# Altium schematic sheet [Acoustics] Power.SchDoc: Sample Sheet Title
size B; Date: MM/DD/YYYY; Author: Nathan A, Rebecca Y, Rebecca L; Organization: ORGANIZATION; Address1: ADDRESS 1; Address2: ADDRESS 2; Address3: ADDRESS 3; Address4: ADDRESS 4; Revision: -; SheetNumber: 3; SheetTotal: 6; ENG_APP_DATE: --/--/--; DSN_APP_DATE: --/--/--; CHK_APP_DATE: --/--/--
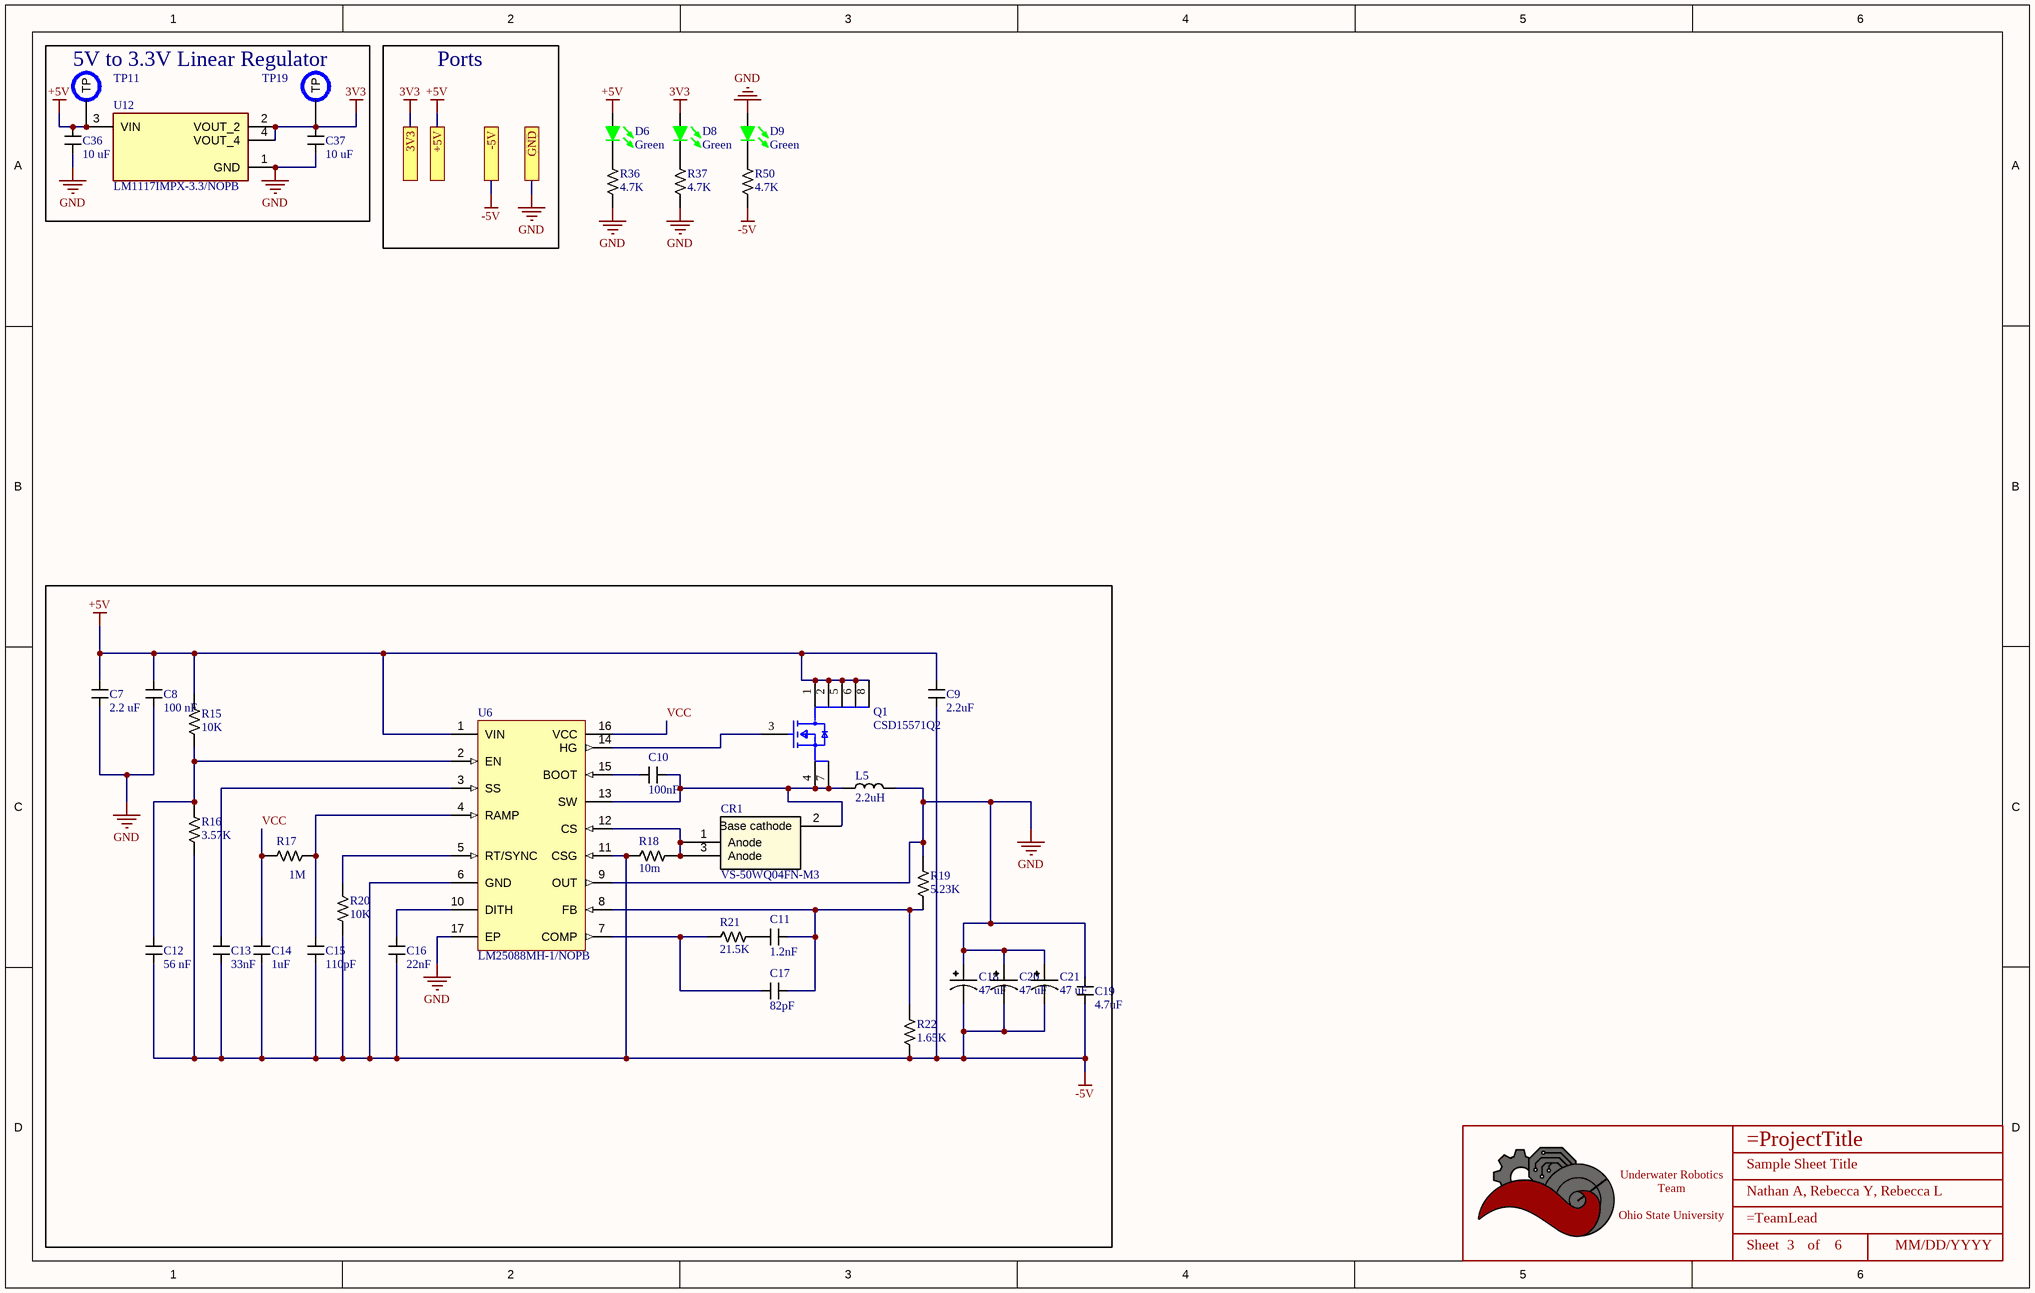
[diagram p0: [Acoustics] Power.SchDoc]

## Parts
*  Title_Block  [LOGO]  (value not drawn)  (graphical)
C7  value 2.2 uF  [CAPACITOR_0402]  (hidden comment: 1uF Ceramic 16V)
C8  value 100 nF  [CAPACITOR_0402]  (hidden comment: 1uF Ceramic 16V)
C9  value 2.2uF  [CAPACITOR_0402]  (hidden comment: 1uF Ceramic 16V)
C10  value 100nF  [CAPACITOR_0402]  (hidden comment: 1uF Ceramic 16V)
C11  value 1.2nF  [CAPACITOR_0402]  (hidden comment: 1uF Ceramic 16V)
C12  value 56 nF  [CAPACITOR_0402]  (hidden comment: 1uF Ceramic 16V)
C13  value 33nF  [CAPACITOR_0402]  (hidden comment: 1uF Ceramic 16V)
C14  value 1uF  [CAPACITOR_0402]  (hidden comment: 1uF Ceramic 16V)
C15  value 110pF  [CAPACITOR_0402]  (hidden comment: 1uF Ceramic 16V)
C16  value 22nF  [CAPACITOR_0402]  (hidden comment: 1uF Ceramic 16V)
C17  value 82pF  [CAPACITOR_0402]  (hidden comment: 1uF Ceramic 16V)
C18  Value (uF): 47 uF  [CAPACITOR_1206 - POLAR]  (hidden comment: 10uF Tantalum 16V)
C19  value 4.7uF  [CAPACITOR_0402]  (hidden comment: 1uF Ceramic 16V)
C20  Value (uF): 47 uF  [CAPACITOR_1206 - POLAR]  (hidden comment: 10uF Tantalum 16V)
C21  Value (uF): 47 uF  [CAPACITOR_1206 - POLAR]  (hidden comment: 10uF Tantalum 16V)
C36  Value (uF): 10 uF  [CAPACITOR_0603]  (hidden comment: 10uF Ceramic 6.3V)
C37  Value (uF): 10 uF  [CAPACITOR_0603]  (hidden comment: 10uF Ceramic 6.3V)
CR1  VS-50WQ04FN-M3  [D2PAK_VIS]
D6  Color: Green  [LED_0603]  (hidden comment: IN-S63AT5G)
D8  Color: Green  [LED_0603]  (hidden comment: IN-S63AT5G)
D9  Color: Green  [LED_0603]  (hidden comment: IN-S63AT5G)
L5  value 2.2uH  [INDUCTOR_0402]  (hidden comment: FIXED IND 15NH 250MA 600MOHM SMD)
Q1  CSD15571Q2  [FP-DQK0006C-MFG]
R15  Value  (Ohms): 10K  [RESISTOR_0402]  (hidden comment: 1k Ohm 1% 1/16W)
R16  Value  (Ohms): 3.57K  [RESISTOR_0402]  (hidden comment: 1k Ohm 1% 1/16W)
R17  Value  (Ohms): 1M  [RESISTOR_0402]  (hidden comment: 1k Ohm 1% 1/16W)
R18  Value  (Ohms): 10m  [RESISTOR_0402]  (hidden comment: 1k Ohm 1% 1/16W)
R19  Value  (Ohms): 5.23K  [RESISTOR_0402]  (hidden comment: 1k Ohm 1% 1/16W)
R20  Value  (Ohms): 10K  [RESISTOR_0402]  (hidden comment: 1k Ohm 1% 1/16W)
R21  Value  (Ohms): 21.5K  [RESISTOR_0402]  (hidden comment: 1k Ohm 1% 1/16W)
R22  Value  (Ohms): 1.65K  [RESISTOR_0402]  (hidden comment: 1k Ohm 1% 1/16W)
R36  Value  (Ohms): 4.7K  [RESISTOR_0603]  (hidden comment: 4.7k Ohm 5% 1/10W)
R37  Value  (Ohms): 4.7K  [RESISTOR_0603]  (hidden comment: 4.7k Ohm 5% 1/10W)
R50  Value  (Ohms): 4.7K  [RESISTOR_0603]  (hidden comment: 4.7k Ohm 5% 1/10W)
TP11  PCB Test Point  [TESTPOINT_1.2MM]  (value not drawn)  (no BOM)
TP19  PCB Test Point  [TESTPOINT_1.2MM]  (value not drawn)  (no BOM)
U6  LM25088MH-1/NOPB  [PWP0016A_N]
U12  LM1117IMPX-3.3/NOPB  [SOT-223-4]

## Blocks framed on the sheet
5V to 3.3V Linear Regulator: C36 C37 TP11 TP19 U12

## Ports
3V3, +5V, -5V, GND

## Nets
3V3: C37.1 D8.1 TP19.TP U12.2(VOUT_2) U12.4(VOUT_4) ; port 3V3
+5V: C7.1 C8.1 C9.1 C36.1 D6.1 Q1.1(D) Q1.2(D) Q1.5(D) Q1.6(D) Q1.8(D) R15.1 TP11.TP U6.1(VIN) U12.3(VIN) ; port +5V
-5V: C9.2 C12.2 C13.2 C14.2 C15.2 C16.2 C18.2 C19.2 C20.2 C21.2 R16.2 R18.2 R20.1 R22.2 R50.2 U6.6(GND) U6.11(CSG) ; port -5V
GND: C7.2 C8.2 C18.1 C19.1 C20.1 C21.1 C36.2 C37.2 D9.1 L5.1 R19.1 R36.2 R37.2 U6.9(OUT) U6.17(EP) U12.1(GND) ; port GND
VCC: C14.1 R17.1 U6.16(VCC)
NetC10_1: C10.1 CR1.2(Base_cathode) L5.2 Q1.4(S) Q1.7(S) U6.13(SW)
NetC10_2: C10.2 U6.15(BOOT)
NetC11_1: C11.1 C17.1 R19.2 R22.1 U6.8(FB)
NetC11_2: C11.2 R21.1
NetC12_1: C12.1 R15.2 R16.1 U6.2(EN)
NetC13_1: C13.1 U6.3(SS)
NetC15_1: C15.1 R17.2 U6.4(RAMP)
NetC16_1: C16.1 U6.10(DITH)
NetC17_2: C17.2 R21.2 U6.7(COMP)
NetCR1_1: CR1.1(Anode) CR1.3(Anode) R18.1 U6.12(CS)
NetD6_2: D6.2 R36.1
NetD8_2: D8.2 R37.1
NetD9_2: D9.2 R50.1
NetQ1_3: Q1.3(G) U6.14(HG)
NetR20_2: R20.2 U6.5(RT/SYNC)

## Notes on the sheet
- Ports
- DWG. NO.
- REV.
- SHT.
- THIS DOCUMENT AND THE DATA DISCLOSED HEREIN OR HEREWITH IS THE PROPERTY OF ALTIUM LIMITED AND MAY BE FREELY DISTRIBUTED IN WHOLE. NO RIGHTS ARE RESERVED OR EXPRESS OR IMPLIED WARANTEE GIVEN.
- REVISION
- DESCRIPTION
- DATE
- APPROVED
- ENG:
- APPROVALS
- PROJECT
- DSN:
- CHK:
- REFERENCE DOCUMENTS
- PROJECT REVISION:
- TITLE
- DOCUMENT REVISION:
- DESIGN ITEM:
- BOM:
- FAB DWG:
- PCB DWG:
- ASSY DWG:
- SCALE:
- SIZE
- B
- CAGE CODE
- FILE NAME
- DWG NO.
- SHEET
- OF
- REV
- (in symbol Title_Block) Underwater Robotics Team / Ohio State University; Sheet; of

## Library data of the parts
* = Title_Block: UWRT Schematic Title Block Template / Created June 2021, Dylan Trainor
C7-C17 C19 = CAPACITOR_1uF_0402: Cap 1uF 16V +/-10% / Ceramic 0402; Made By: Robert Pafford; Tolerance: +/- 10%; Voltage: 16V; Supplier 1: Digikey
  C7 C9: Supplier Part Number 1: 445-9097-1-ND
  C8 C10: Supplier Part Number 1: 399-C0402C104K8PACTUCT-ND
  C11: Supplier Part Number 1: 311-1031-1-ND
  C12: Supplier Part Number 1: 311-3805-1-ND
  C13: Supplier Part Number 1: 490-3253-1-ND
  C14: Supplier Part Number 1: 399-C0402C105K8PACTUCT-ND
  C15: Supplier Part Number 1: 399-C0402C110J5GACTUCT-ND
  C16: Supplier Part Number 1: 311-1722-1-ND
  C17: Supplier Part Number 1: 490-GCM1555C1H820JA16DCT-ND
  C19: Supplier Part Number 1: 445-13820-1-ND
C18 C20 C21 = CAPACITOR_10uF_1206_Tantalum_1: Cap 10uF 16V +/-20% / Tantalum 1206; Tolerance: +/- 10%; Made By: Dylan T; ComponentLink1Description: Digikey; ComponentLink1URL: https://www.digikey.com/en/products/detail/kyocera-avx/F981A106MMA/4004990; Voltage: 16V; Supplier 1: Digikey; Supplier Part Number 1: 478-5800-1-ND
C36 C37 = CAPACITOR_10uF_0603: Cap 10uF 6.3V +/-20% / Ceramic 0603; Made By: Flip B; ComponentLink1Description: Digikey; ComponentLink1URL: https://www.digikey.com/en/products/detail/samsung-electro-mechanics/CL10A106MQ8NNNC/3886777; Supplier 1: Digi-Key; Supplier Part Number 1: 1276-1119-1-ND; Tolerance: +/- 20%; Voltage: 6.3V
CR1 = VS-50WQ04FN-M3: No Description Available; Mfr_Name: Vishay; RefDes: RefDes; Type: Type; Supplier 1: Digikey; Supplier Part Number 1: VS-50WQ04FN-M3-ND
D6 D8 D9 = LED_Green_0603_3V: LED Green Vf= 3V If = 0.005A / IN-S63AT5G; Made By: Robert Pafford; Forward Current: 5mA; ComponentLink1Description: Datasheet; ComponentLink1URL: https://www.we-online.de/katalog/datasheet/150060GS75000.pdf; Forward Voltage: 3V; Package: 0603; Supplier 1: Digi-Key; Supplier Part Number 1: 1830-1062-1-ND
L5 = INDUCTOR_15nH_0402: 15 nH Unshielded Multilayer Inductor 250 mA 600mOhm Max 0402 (1005 Metric); Tolerance: +/- 5%; Supplier 1: Digikey; Supplier Part Number 1: 445-6381-1-ND
Q1 = CMP-04962-000051-1: MOSFET N-CH 20V 22A 6SON; Rds On Max: 15mR; Power Dissipation: 2.5W; Turn-Off Delay Time: 9.9ns; Number of Elements: 2; Number of Channels: 1; Turn-On Delay Time: 17.2ns; Input Capacitance: 419pF; Fall Time: 4.1ns; Drain to Source Resistance: 19.2mR; Element Configuration: Single; Contact Plating: Tin; Drain to Source Voltage (Vdss): 20V; Number of Pins: 6; Max Power Dissipation: 2.5W; Min Operating Temperature: -55°C; Max Operating Temperature: 150°C; Packaging: Tape and Reel; Rise Time: 17.2ns; Mount: Surface Mount; Gate to Source Voltage (Vgs): 20V; Drain to Source Breakdown Voltage: 20V; Lead Free: Lead Free; Continuous Drain Current (ID): 22A; Package Quantity: 3000
R15-R22 = RESISTOR_1K_0402: RES 1k OHM 1% 1/16W 0402; Tolerance: +/- 1%; Made By: Robert Pafford; Wattage: 1/16W; Supplier: Digikey; Digikey Part Numer: CR0603-JW-104ELFTR-ND; Supplier 1: Digikey
  R15 R20: Supplier Part Number 1: P10.0KLCT-ND
  R16: Supplier Part Number 1: YAG3150CT-ND
  R17: Supplier Part Number 1: 541-1.00MLCT-ND
  R18: Supplier Part Number 1: P19181CT-ND
  R19: Supplier Part Number 1: P5.23KLCT-ND
  R21: Supplier Part Number 1: P21.5KLCT-ND
  R22: Supplier Part Number 1: 541-1.65KLCT-ND
R36 R37 R50 = RESISTOR_4.7K_0603: RES 4.7k OHM 5% 1/10W 0603; Tolerance: +/- 5%; Made By: Robert Pafford; Wattage: 1/10W; Supplier: Digikey; Digikey Part Numer: CR0603-JW-104ELFTR-ND; Supplier 1: Digi-Key; Supplier Part Number 1: RMCF0603JT4K70CT-ND
TP11 TP19 = TESTPOINT: Made By: Robert Pafford
U6 = CMP-0063-01290-3: Wide Input Range Non-Synchronous Buck Controller, 16-pin TSSOP-EP, Pb-Free; Manufacturer: Texas Instruments; PowerWise: Y; CompType: MiscPower; PackageTopMarking: NSUZXYTT*L25088*MH-1; Code_JEDEC: MO-153-ABT; PinCount: 16; ComponentLink1Description: Datasheet URL; RoHS: Y; PackageDescription: Molded TSSOP, Jedec, Exposed Pad, 5.0 x 4.4 x 0.9mm Body,16 Lead, 0.65mm Pitch; PackageReference: PWP0016A; ComponentLink1URL: http://www.ti.com/general/docs/lit/getliterature.tsp?genericPartNumber=LM25088&fileType=pdf
U12 = LM1117IMPX-3.3/NOPB: 800-mA 15-V linear voltage regulator 4-SOT-223 -40 to 125; MF: Texas Instruments; Texas_Instruments-Purchase-URL: https://snapeda.com/shop?store=Texas+Instruments&id=410186; Price: None; Mouser-Purchase-URL: https://snapeda.com/shop?store=Mouser&id=410186; MP: LM1117IMPX-3.3/NOPB; Value: *; Availability: Good; Package: SOT-223-4 Texas Instruments; Arrow_Electronics-Purchase-URL: https://snapeda.com/shop?store=Arrow+Electronics&id=410186; SnapEDA_Link: https://www.snapeda.com/parts/LM1117IMPX-3.3/NOPB/Texas%20Instruments/view-part/410186/?ref=snap; DigiKey-Purchase-URL: https://snapeda.com/shop?store=DigiKey&id=410186